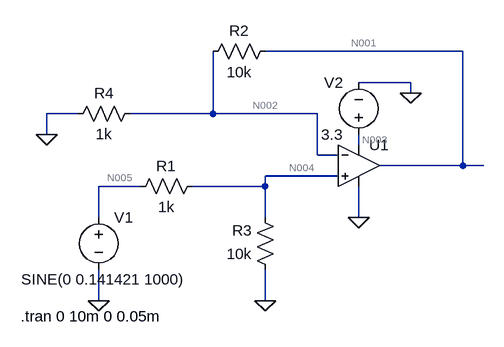
[diagram p0: schematic q1analoguelab2.asc]
q1analoguelab2.asc, the LTspice schematic file:
Version 4
SHEET 1 880 680
WIRE 640 -128 336 -128
WIRE 560 -80 480 -80
WIRE 560 -64 560 -80
WIRE 48 -32 0 -32
WIRE 256 -32 256 -128
WIRE 256 -32 128 -32
WIRE 416 -32 256 -32
WIRE 0 0 0 -32
WIRE 480 16 480 0
WIRE 416 32 416 -32
WIRE 448 32 416 32
WIRE 640 48 640 -128
WIRE 640 48 512 48
WIRE 672 48 640 48
WIRE 448 64 336 64
WIRE 144 80 80 80
WIRE 336 80 336 64
WIRE 336 80 224 80
WIRE 80 128 80 80
WIRE 336 128 336 80
WIRE 480 128 480 80
WIRE 80 256 80 208
WIRE 336 256 336 208
FLAG 0 0 0
FLAG 480 128 0
FLAG 336 256 0
FLAG 80 256 0
FLAG 560 -64 0
SYMBOL voltage 80 112 R0
WINDOW 3 -119 111 Left 2
WINDOW 123 0 0 Left 2
WINDOW 39 0 0 Left 2
SYMATTR InstName V1
SYMATTR Value SINE(0 0.141421 1000)
SYMBOL res 240 64 R90
WINDOW 0 0 56 VBottom 2
WINDOW 3 32 56 VTop 2
SYMATTR InstName R1
SYMATTR Value 1k
SYMBOL res 352 -144 R90
WINDOW 0 0 56 VBottom 2
WINDOW 3 32 56 VTop 2
SYMATTR InstName R2
SYMATTR Value 10k
SYMBOL res 352 224 R180
WINDOW 0 36 76 Left 2
WINDOW 3 36 40 Left 2
SYMATTR InstName R3
SYMATTR Value 10k
SYMBOL res 144 -48 R90
WINDOW 0 0 56 VBottom 2
WINDOW 3 32 56 VTop 2
SYMATTR InstName R4
SYMATTR Value 1k
SYMBOL Opamps\\UniversalOpamp2 480 48 R0
SYMATTR InstName U1
SYMBOL voltage 480 16 R180
WINDOW 0 24 96 Left 2
WINDOW 3 24 16 Left 2
SYMATTR InstName V2
SYMATTR Value 3.3
TEXT -40 280 Left 2 !.tran 0 10m 0 0.05m

The netlist it stands for:
* q1analoguelab2.asc
V1 N005 0 SINE(0 0.141421 1000)
R1 N004 N005 1k
R2 N001 N002 10k
R3 0 N004 10k
R4 N002 0 1k
XU1 N004 N002 N003 0 N001 level.2 Avol=1Meg GBW=10Meg Slew=10Meg ilimit=25m rail=0 Vos=0 phimargin=45 en=0 enk=0 in=0 ink=0 Rin=500Meg  ; pins IN+ IN- V+ V- OUT
V2 N003 0 3.3
.tran 0 10m 0 0.05m
.lib UniversalOpamps2.sub
.backanno
.end

* Results of the author's LTspice run, read from the files saved beside the schematic
* Operating Point, zero values left out:
*   V(n004) = 3 µV
*   V(n001) = 17.33 mV
*   V(n002) = 1.578 mV
*   V(n003) = 3.3 V
*   I(R4) = 1.578 µA
*   I(R3) = -300 pA
*   I(R2) = 1.575 µA
*   I(R1) = 3 nA
*   I(V2) = -24.68 µA
*   I(V1) = 3 nA
*   Ix(u1:1) = -3.3 nA
*   Ix(u1:2) = -3.297 nA
*   Ix(u1:3) = 24.68 µA
*   Ix(u1:4) = -23.08 µA
*   Ix(u1:5) = -1.575 µA
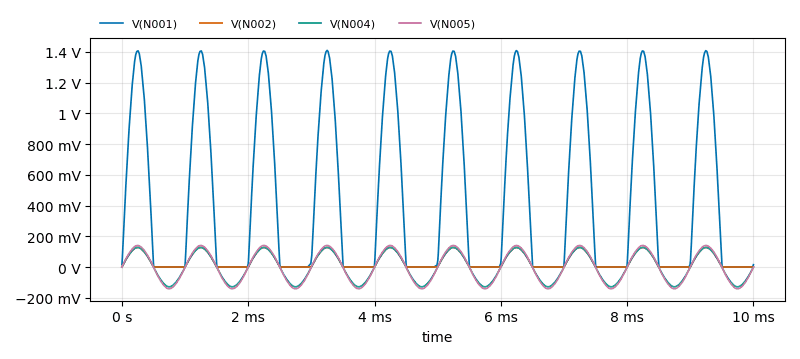
[diagram p1: Transient Analysis of q1analoguelab2.asc, plotted from the saved traces]
* Transient Analysis, 1 run:
*   V(N001): min 4.294 µV, max 1.411 V, average 442.3 mV, rms 698.1 mV, last 15.86 mV
*   V(N002): min 3.39 µV, max 128.2 mV, average 40.21 mV, rms 63.46 mV, last 1.445 mV
*   V(N004): min -128.2 mV, max 128.2 mV, average 40.29 µV, rms 89.74 mV, last 3 µV
*   V(N005): min -141.1 mV, max 141.1 mV, average 41.02 µV, rms 98.71 mV, last 0 V